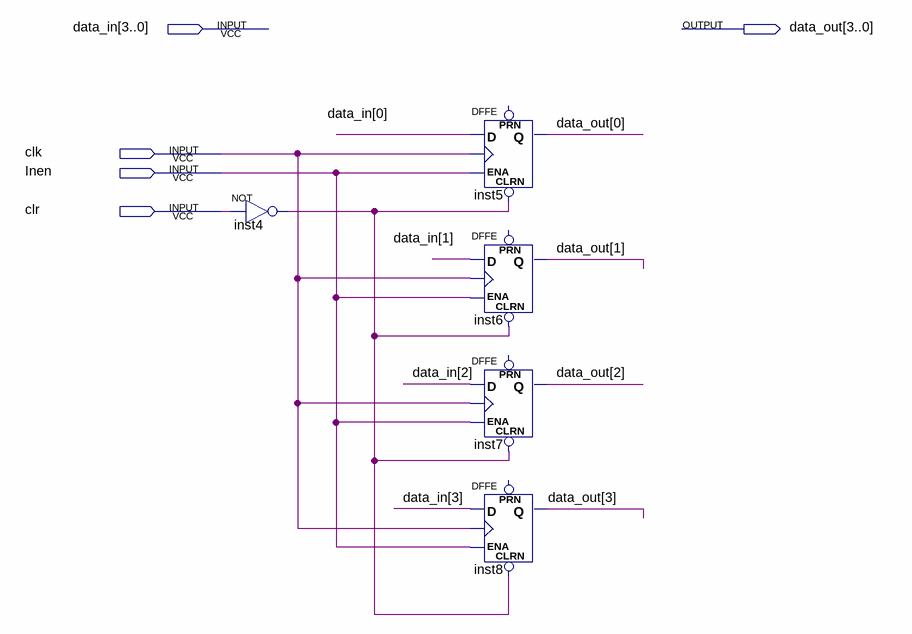
[diagram p0: schematic sheet]
// Quartus schematic Inen4bit.bdf as structural Verilog: 5 symbols, 5 pins
module Inen4bit (
  input  [3:0] data_in,
  input  clk,
  input  Inen,
  input  clr,
  output [3:0] data_out
);

  wire inst4_out;

  not inst4 (inst4_out, clr);
  DFFE inst5 (.CLRN(inst4_out), .D(data_in[0]), .CLK(clk), .ENA(Inen), .Q(data_out[0]));  // open: PRN
  DFFE inst6 (.CLRN(inst4_out), .D(data_in[1]), .CLK(clk), .ENA(Inen), .Q(data_out[1]));  // open: PRN
  DFFE inst7 (.CLRN(inst4_out), .D(data_in[2]), .CLK(clk), .ENA(Inen), .Q(data_out[2]));  // open: PRN
  DFFE inst8 (.CLRN(inst4_out), .D(data_in[3]), .CLK(clk), .ENA(Inen), .Q(data_out[3]));  // open: PRN
endmodule
